# Altium project Flight_controller v1.0.PrjPcb (part 2 of 3)

## Sheet Power_Supply.SchDoc
size A3; Revision: v10; SheetNumber: 3; SheetTotal: 5
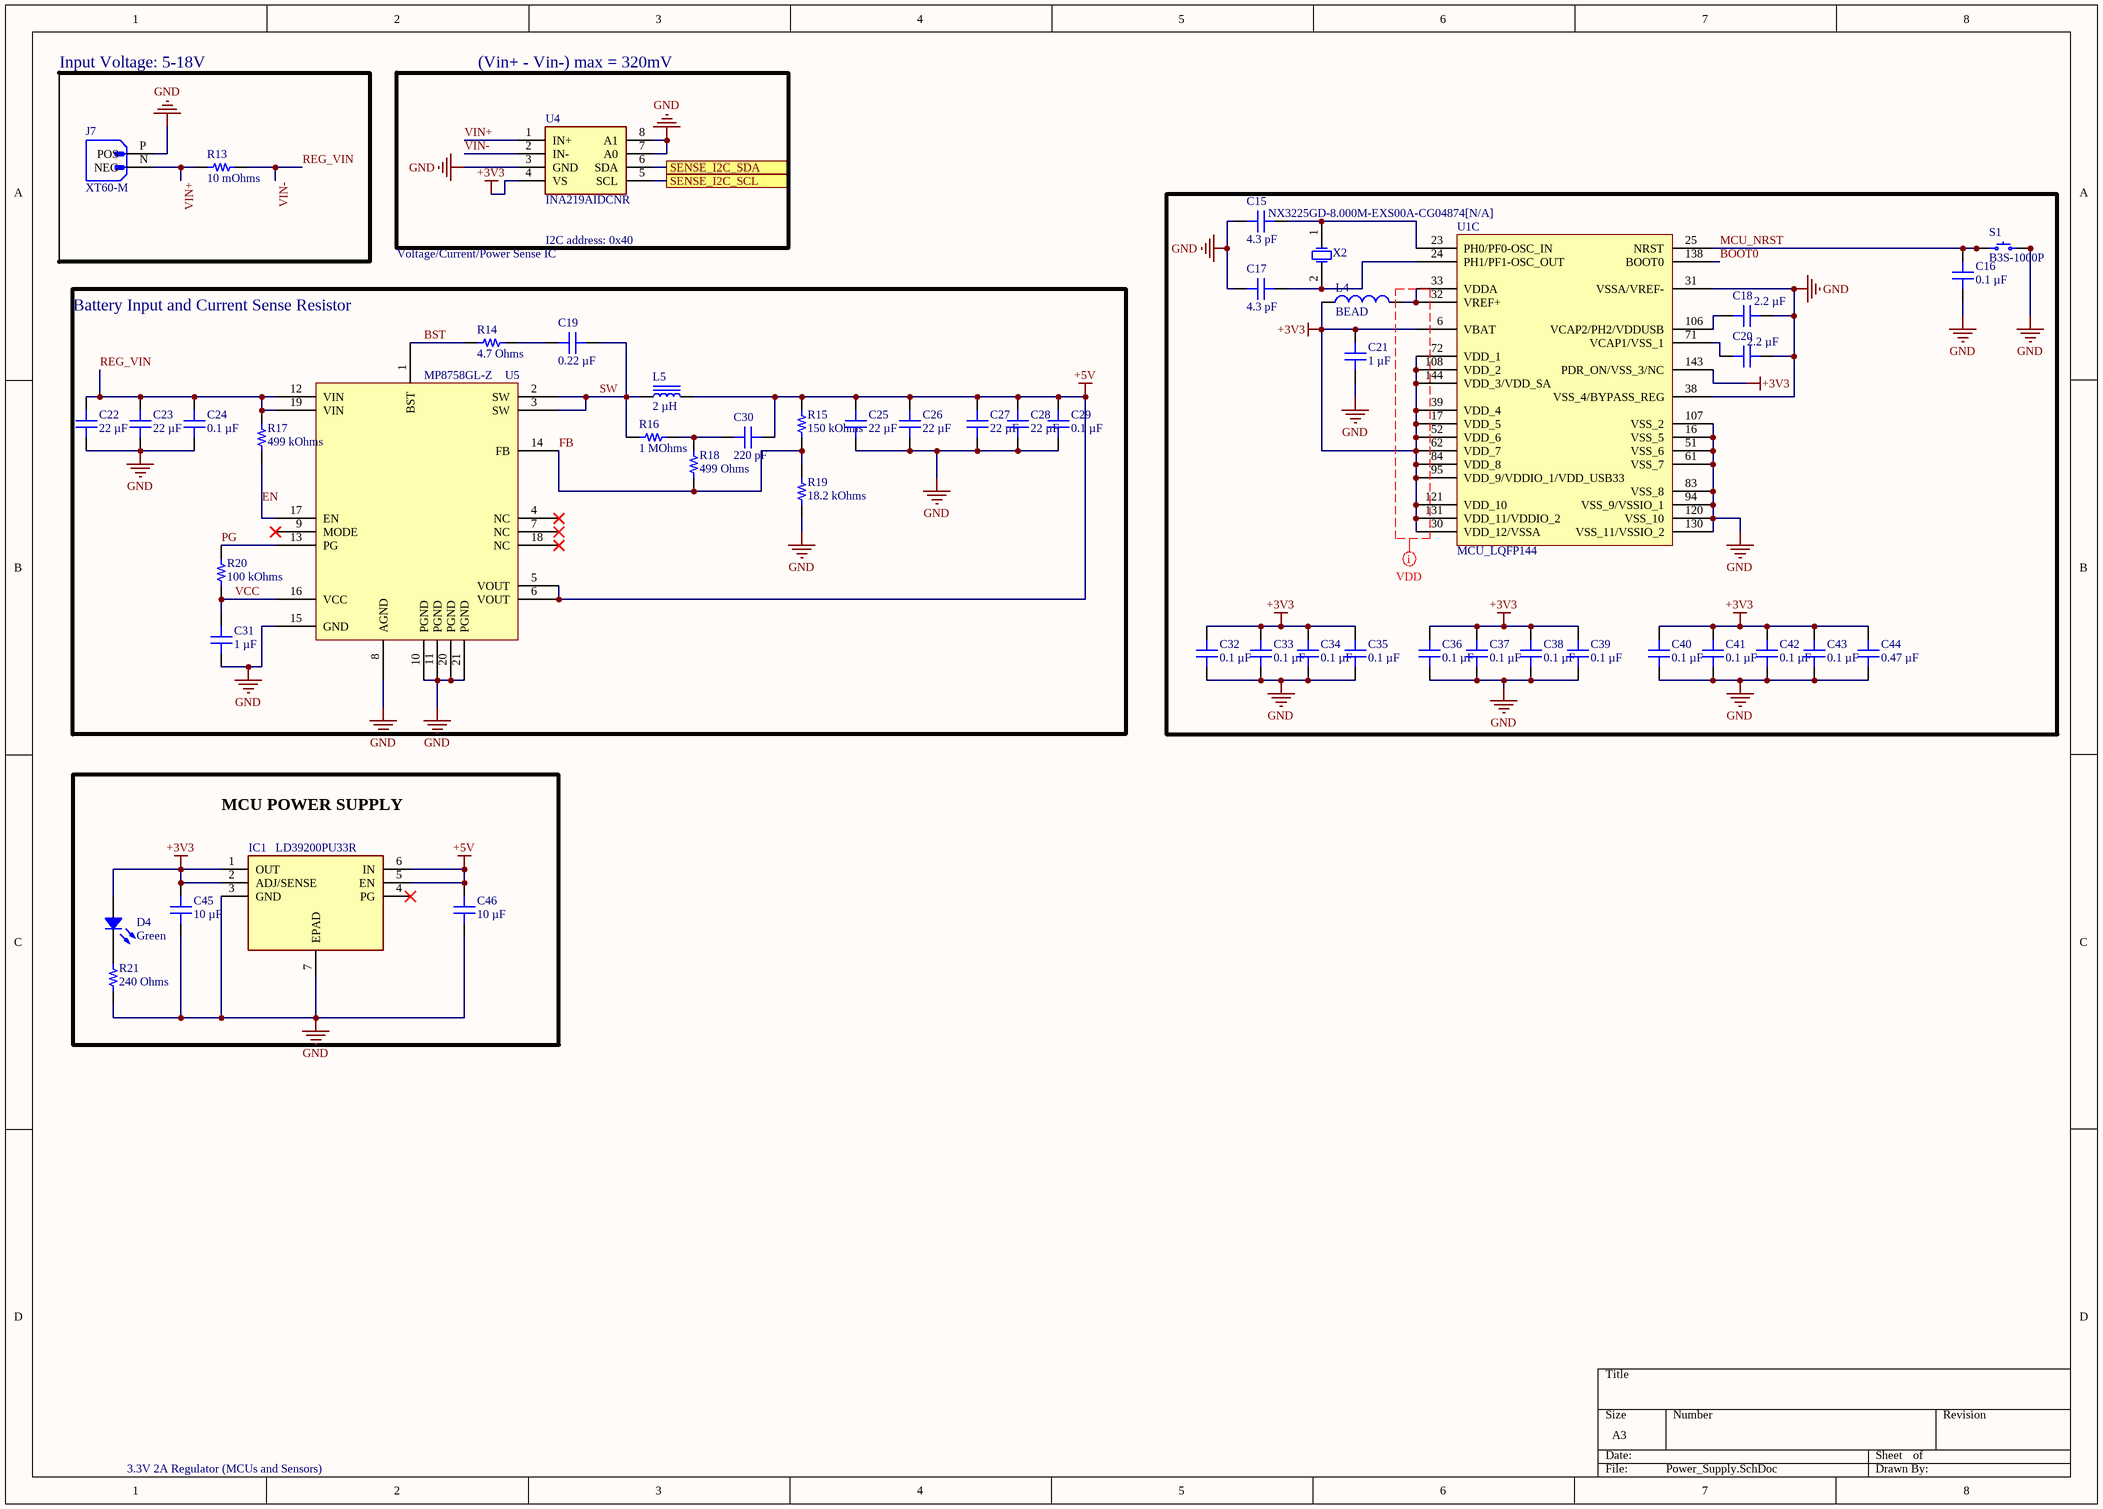
[diagram p2: Power_Supply.SchDoc]

### Parts
C15  4.3 pF  [CAP 0603_1608]
C16  0.1 µF  [CAP 0603_1608]
C17  4.3 pF  [CAP 0603_1608]
C18  2.2 µF  [CAP 1206_3216 - 0.8MM]
C19  0.22 µF  [CAP 0603_1608]
C20  2.2 µF  [CAP 1206_3216 - 0.8MM]
C21  1 µF  [CAP 0603_1608]
C22  22 µF  [CAP 1206_3216 - 0.8MM]
C23  22 µF  [CAP 1206_3216 - 0.8MM]
C24  value 0.1 µF  [CAP 0805_2012]  (hidden comment: 0.1µF)
C25  22 µF  [CAP 1206_3216 - 0.8MM]
C26  22 µF  [CAP 1206_3216 - 0.8MM]
C27  22 µF  [CAP 1206_3216 - 0.8MM]
C28  22 µF  [CAP 1206_3216 - 0.8MM]
C29  value 0.1 µF  [CAP 0603_1608]  (hidden comment: 2.2 µF)
C30  220 pF  [CAP 0603_1608]
C31  1 µF  [CAP 0603_1608]
C32  0.1 µF  [CAP 0603_1608]
C33  0.1 µF  [CAP 0603_1608]
C34  0.1 µF  [CAP 0603_1608]
C35  0.1 µF  [CAP 0603_1608]
C36  0.1 µF  [CAP 0603_1608]
C37  0.1 µF  [CAP 0603_1608]
C38  0.1 µF  [CAP 0603_1608]
C39  0.1 µF  [CAP 0603_1608]
C40  0.1 µF  [CAP 0603_1608]
C41  0.1 µF  [CAP 0603_1608]
C42  0.1 µF  [CAP 0603_1608]
C43  0.1 µF  [CAP 0603_1608]
C44  value 0.47 µF  [CAP 1206_3216 - 1.8MM]  (hidden comment: 22µF)
C45  value 10 µF  [CAP 1206_3216 - 1.8MM]  (hidden comment: 22µF)
C46  value 10 µF  [CAP 0603_1608]  (hidden comment: 0.1 µF)
D4  Green  [LED 0603_1608 GREEN]
IC1  LD39200PU33R  [SON95P300X300X100-7N-D]
J7  XT60-M  [AMASS_XT60-M]
L4  BEAD  [IND_FCM1608_TTC]
L5  2 µH  [WURTH WE-HCI 1365]
R13  10 mOhms  [RES 2512_6432]
R14  4.7 Ohms  [RES 0603_1608]
R15  value 150 kOhms  [RES 0805_2012]  (hidden comment: 6.8 kOhms)
R16  1 MOhms  [RES 0603_1608]
R17  value 499 kOhms  [RES 0805_2012]  (hidden comment: 1.3 kOhms)
R18  499 Ohms  [RES 0603_1608]
R19  value 18.2 kOhms  [RES 0805_2012]  (hidden comment: 10 kOhms)
R20  100 kOhms  [RES 0603_1608]
R21  value 240 Ohms  [RES 0603_1608]  (hidden comment: 160 kOhms)
S1  B3S-1000P  [OMRON B3S-1000P]
U1  MCU_LQFP144  [LQFP144-20x20mm]  (part C of 3)
U4  INA219AIDCNR  [SOP65P280X145-8N]
U5  MP8758GL-Z  [MP8758HGL-Z]
X2  NX3225GD-8.000M-EXS00A-CG04874[N/A]  [XTAL_NX3225GD_NDK]

### Blocks framed on the sheet
Input Voltage: 5-18V: J7 R13
(Vin+ - Vin-) max = 320mV: U4
Battery Input and Current Sense Resistor: C19 C22-C31 L5 R14-R20 U5
MCU POWER SUPPLY: C45 C46 D4 IC1 R21

### Ports
SENSE_I2C_SCL, SENSE_I2C_SDA

### Nets
+3V3: C21.2 C32.2 C33.2 C34.2 C35.2 C36.2 C37.2 C38.2 C39.2 C40.2 C41.2 C42.2 C43.2 C44.2 C45.2 D4.1 IC1.1(OUT) IC1.2(ADJ/SENSE) L4.1 U1.6(VBAT) U1.17(VDD_5) U1.30(VDD_12/VSSA) U1.39(VDD_4) U1.52(VDD_6) U1.62(VDD_7) U1.72(VDD_1) U1.84(VDD_8) U1.95(VDD_9/VDDIO_1/VDD_USB33) U1.108(VDD_2) U1.121(VDD_10) U1.131(VDD_11/VDDIO_2) U1.143(PDR_ON/VSS_3/NC) U1.144(VDD_3/VDD_SA) U4.4(VS)
+5V: C25.2 C26.2 C27.2 C28.2 C29.2 C30.2 C46.2 IC1.5(EN) IC1.6(IN) L5.2 R15.2 U5.5(VOUT) U5.6(VOUT)
GND: C15.1 C16.1 C17.1 C18.2 C20.2 C21.1 C22.1 C23.1 C24.1 C25.1 C26.1 C27.1 C28.1 C29.1 C31.1 C32.1 C33.1 C34.1 C35.1 C36.1 C37.1 C38.1 C39.1 C40.1 C41.1 C42.1 C43.1 C44.1 C45.1 C46.1 IC1.3(GND) IC1.7(EPAD) J7.P(POS) R19.1 R21.1 S1.3 S1.4 U1.16(VSS_5) U1.31(VSSA/VREF-) U1.38(VSS_4/BYPASS_REG) U1.51(VSS_6) U1.61(VSS_7) U1.83(VSS_8) U1.94(VSS_9/VSSIO_1) U1.107(VSS_2) U1.120(VSS_10) U1.130(VSS_11/VSSIO_2) U4.3(GND) U4.7(A0) U4.8(A1) U5.8(AGND) U5.10(PGND) U5.11(PGND) U5.15(GND) U5.20(PGND) U5.21(PGND)
BOOT0: U1.138(BOOT0)
BST: R14.1 U5.1(BST)
EN: R17.1 U5.17(EN)
FB: R15.1 R18.1 R19.2 U5.14(FB)
I2C1_SCA: U4.6(SDA) ; port SENSE_I2C_SDA
I2C1_SCL: U4.5(SCL) ; port SENSE_I2C_SCL
MCU_NRST: C16.2 S1.1 S1.2 U1.25(NRST)
PG: R20.2 U5.13(PG)
REG_VIN: C22.2 C23.2 C24.2 R13.2 R17.2 U4.2(IN-) U5.12(VIN) U5.19(VIN)  [also labelled VIN-]
SW: C19.2 L5.1 R16.2 U5.2(SW) U5.3(SW)
VCC: C31.2 R20.1 U5.16(VCC)
VIN+: J7.N(NEG) R13.1 U4.1(IN+)
NetC15_2: C15.2 U1.23(PH0/PF0-OSC_IN) X2.1(OSC1)
NetC17_2: C17.2 U1.24(PH1/PF1-OSC_OUT) X2.2(OSC2)
NetC18_1: C18.1 U1.106(VCAP2/PH2/VDDUSB)
NetC19_1: C19.1 R14.2
NetC20_1: C20.1 U1.71(VCAP1/VSS_1)
NetC30_1: C30.1 R16.1 R18.2
NetD4_2: D4.2 R21.2
NetL4_2: L4.2 U1.32(VREF+) U1.33(VDDA)

Not connected (* = marked no-connect by the designer): IC1 4(PG)*; U5 4(NC)* 7(NC)* 9(MODE)* 18(NC)*

### Layout directives
net class VDD: (no net found under the mark)

### Notes on the sheet
- I2C address: 0x40
- Voltage/Current/Power Sense IC
- 3.3V 2A Regulator (MCUs and Sensors)

### Library data of the parts
C15 C17 = CC0603CRNPO9BN4R3: CAP CER 4.3PF 50V C0G/NPO 0603; manufacturer: Yageo; Temperature Coefficient: C0G, NP0; Tolerance: ±0.25pF; Part Number: CC0603CRNPO9BN4R3; Value: 4.3 pF; Applications: General Purpose; Capacitance: 4.3 pF; componentlink1description: Datasheet; componentlink1url: https://www.yageo.com/upload/media/product/productsearch/datasheet/mlcc/UPY-GP_NP0_16V-to-50V_17.pdf; componentlink2description: DigiKey Link; componentlink2url: https://www.digikey.com/en/products/detail/yageo/CC0603CRNPO9BN4R3/5883456; Device Package: 0603 (1608 Metric); lastupdated: 3.03.2023 20:08:13; Lifecycle Status: Active; Minimum Order: 1; Mounting Type: Surface Mount, MLCC; Operating Temperature: -55°C ~ 125°C; Package / Case: 0603 (1608 Metric); packaging: TapeAndReel; partid: 15526; Part Status: Active; price: 0.01; series: CC; Size / Dimension: 0.063" L x 0.031" W (1.60mm x 0.80mm); Supplier 1: DigiKey; Supplier Part Number 1: 311-3858-1-ND; Thickness (Max): 0.035" (0.90mm); Voltage - Rated: 50V
C16 C32-C43 = CC0603KRX7R7BB104: CAP CER 0.1UF 16V X7R 0603; manufacturer: Yageo; Tolerance: ±10%; Part Number: CC0603KRX7R7BB104; Value: 0.1 µF; Applications: General Purpose; Capacitance: 0.1 µF; componentlink1description: Datasheet; componentlink1url: https://www.yageo.com/upload/media/product/productsearch/datasheet/mlcc/UPY-GPHC_X7R_6.3V-to-50V_18.pdf; componentlink2description: DigiKey Link; Device Package: 0603 (1608 Metric); Lifecycle Status: Active; Minimum Order: 1; Mounting Type: Surface Mount, MLCC; Operating Temperature: -55°C ~ 125°C; Package / Case: 0603 (1608 Metric); packaging: TapeAndReel; partid: 16746; Part Status: Active; price: 0.01; series: CC; Size / Dimension: 0.063" L x 0.031" W (1.60mm x 0.80mm); Supplier 1: DigiKey; Supplier Part Number 1: 311-1088-1-ND; Temperature Coefficient: X7R; Thickness (Max): 0.035" (0.90mm); Voltage - Rated: 16V
  C16: componentlink2url: https://www.digikey.com/en/products/detail/yageo/CC0603KRX7R7BB104/302822; lastupdated: 8.03.2023 20:08:09
  C32-C43: lastupdated: 20.02.2023 20:07:33
C18 C20 = CC1206KKX7R7BB225: CAP CER 2.2UF 16V X7R 1206; manufacturer: Yageo; Tolerance: ±10%; Part Number: CC1206KKX7R7BB225; Value: 2.2 µF; Applications: General Purpose; Capacitance: 2.2 µF; componentlink1description: Datasheet; componentlink1url: https://www.yageo.com/upload/media/product/productsearch/datasheet/mlcc/UPY-GPHC_X7R_6.3V-to-50V_18.pdf; componentlink2description: DigiKey Link; componentlink2url: https://www.digikey.com/en/products/detail/yageo/CC1206KKX7R7BB225/5195363; Device Package: 1206 (3216 Metric); lastupdated: 20.02.2023 20:13:55; Lifecycle Status: Active; Minimum Order: 1; Mounting Type: Surface Mount, MLCC; Operating Temperature: -55°C ~ 125°C; Package / Case: 1206 (3216 Metric); packaging: TapeAndReel; partid: 21752; Part Status: Active; price: 0.05; series: CC; Size / Dimension: 0.126" L x 0.063" W (3.20mm x 1.60mm); Supplier 1: DigiKey; Supplier Part Number 1: 311-1957-1-ND; Temperature Coefficient: X7R; Thickness (Max): 0.049" (1.25mm); Voltage - Rated: 16V
C19 = CL10B224KA8NNNC: CAP CER 0.22UF 25V X7R 0603; manufacturer: Samsung Electro-Mechanics; Tolerance: ±10%; Part Number: CL10B224KA8NNNC; Value: 0.22 µF; Applications: General Purpose; Capacitance: 0.22 µF; componentlink1description: Datasheet; componentlink1url: http://www.samsungsem.com/kr/support/product-search/mlcc/CL10B224KA8NNNC.jsp; componentlink2description: DigiKey Link; componentlink2url: https://www.digikey.com/en/products/detail/samsung-electro-mechanics/CL10B224KA8NNNC/3886769; Device Package: 0603 (1608 Metric); lastupdated: 3.03.2023 20:08:19; Lifecycle Status: Active; Minimum Order: 1; Mounting Type: Surface Mount, MLCC; Operating Temperature: -55°C ~ 125°C; Package / Case: 0603 (1608 Metric); packaging: TapeAndReel; partid: 14278; Part Status: Active; price: 0.01; series: CL; Size / Dimension: 0.063" L x 0.031" W (1.60mm x 0.80mm); Supplier 1: DigiKey; Supplier Part Number 1: 1276-1111-1-ND; Temperature Coefficient: X7R; Thickness (Max): 0.035" (0.90mm); Voltage - Rated: 25V
C21 = CL10A105KO8NNNC: CAP CER 1UF 16V X5R 0603; manufacturer: Samsung Electro-Mechanics; Tolerance: ±10%; Part Number: CL10A105KO8NNNC; Value: 1 µF; Applications: General Purpose; Capacitance: 1 µF; componentlink1description: Datasheet; componentlink1url: http://www.samsungsem.com/kr/support/product-search/mlcc/CL10A105KO8NNNC.jsp; componentlink2description: DigiKey Link; componentlink2url: https://www.digikey.com/en/products/detail/samsung-electro-mechanics/CL10A105KO8NNNC/3886692; Device Package: 0603 (1608 Metric); lastupdated: 28.02.2023 20:08:28; Lifecycle Status: Active; Minimum Order: 1; Mounting Type: Surface Mount, MLCC; Operating Temperature: -55°C ~ 85°C; Package / Case: 0603 (1608 Metric); packaging: TapeAndReel; partid: 5514; Part Status: Active; price: 0.01; series: CL; Size / Dimension: 0.063" L x 0.031" W (1.60mm x 0.80mm); Supplier 1: DigiKey; Supplier Part Number 1: 1276-1034-1-ND; Temperature Coefficient: X5R; Thickness (Max): 0.035" (0.90mm); Voltage - Rated: 16V
C22 C23 = CL31A226KAHNNNE: CAP CER 22UF 25V X5R 1206; manufacturer: Samsung Electro-Mechanics; Tolerance: ±10%; Part Number: CL31A226KAHNNNE; Value: 22 µF; Applications: General Purpose; Capacitance: 22 µF; componentlink1description: Datasheet; componentlink1url: http://www.samsungsem.com/kr/support/product-search/mlcc/CL31A226KAHNNNE.jsp; componentlink2description: DigiKey Link; componentlink2url: https://www.digikey.com/en/products/detail/samsung-electro-mechanics/CL31A226KAHNNNE/3888705; Device Package: 1206 (3216 Metric); lastupdated: 3.03.2023 20:14:18; Lifecycle Status: Active; Minimum Order: 1; Mounting Type: Surface Mount, MLCC; Operating Temperature: -55°C ~ 85°C; Package / Case: 1206 (3216 Metric); packaging: TapeAndReel; partid: 22185; Part Status: Active; price: 0.07; series: CL; Size / Dimension: 0.126" L x 0.063" W (3.20mm x 1.60mm); Supplier 1: DigiKey; Supplier Part Number 1: 1276-3047-1-ND; Temperature Coefficient: X5R; Thickness (Max): 0.071" (1.80mm); Voltage - Rated: 25V
C24 C29 = CL10B104KA8NNNC: CAP CER 0.1UF 25V X7R 0603; manufacturer: Samsung Electro-Mechanics; Tolerance: ±10%; Part Number: CL10B104KA8NNNC; Applications: General Purpose; Capacitance: 0.1 µF; componentlink1description: Datasheet; componentlink1url: http://www.samsungsem.com/kr/support/product-search/mlcc/CL10B104KA8NNNC.jsp; componentlink2description: DigiKey Link; componentlink2url: https://www.digikey.com/en/products/detail/samsung-electro-mechanics/CL10B104KA8NNNC/3886664; Device Package: 0603 (1608 Metric); lastupdated: 1.03.2023 20:07:31; Lifecycle Status: Active; Minimum Order: 1; Mounting Type: Surface Mount, MLCC; Operating Temperature: -55°C ~ 125°C; Package / Case: 0603 (1608 Metric); packaging: TapeAndReel; partid: 9793; Part Status: Active; price: 0.01; series: CL; Size / Dimension: 0.063" L x 0.031" W (1.60mm x 0.80mm); Supplier 1: DigiKey; Supplier Part Number 1: 1276-1006-1-ND; Temperature Coefficient: X7R; Thickness (Max): 0.035" (0.90mm); Voltage - Rated: 25V
C25-C28 = EMK316BJ226ML-T: CAP CER 22UF 16V X5R 1206; manufacturer: Taiyo Yuden; Tolerance: ±20%; Part Number: EMK316BJ226ML-T; Value: 22 µF; Applications: SMPS Filtering; Capacitance: 22 µF; componentlink1description: Datasheet; componentlink1url: https://www.yuden.co.jp/productdata/catalog/mlcc01_e.pdf; componentlink2description: DigiKey Link; componentlink2url: https://www.digikey.com/en/products/detail/taiyo-yuden/EMK316BJ226ML-T/1004021; Device Package: 1206 (3216 Metric); lastupdated: 3.03.2023 20:14:18; Lifecycle Status: Active; Minimum Order: 1; Mounting Type: Surface Mount, MLCC; Operating Temperature: -55°C ~ 85°C; Package / Case: 1206 (3216 Metric); packaging: TapeAndReel; partid: 39350; Part Status: Active; price: 0.11; series: M; Size / Dimension: 0.126" L x 0.063" W (3.20mm x 1.60mm); Supplier 1: DigiKey; Supplier Part Number 1: 587-1433-1-ND; Temperature Coefficient: X5R; Thickness (Max): 0.071" (1.80mm); Voltage - Rated: 16V
C30 = CL10B221KB8NNNC: CAP CER 220PF 50V X7R 0603; manufacturer: Samsung Electro-Mechanics; Tolerance: ±10%; Part Number: CL10B221KB8NNNC; Value: 220 pF; Applications: General Purpose; Capacitance: 220 pF; componentlink1description: Datasheet; componentlink1url: http://www.samsungsem.com/kr/support/product-search/mlcc/CL10B221KB8NNNC.jsp; componentlink2description: DigiKey Link; componentlink2url: https://www.digikey.com/en/products/detail/samsung-electro-mechanics/CL10B221KB8NNNC/3886803; Device Package: 0603 (1608 Metric); lastupdated: 1.03.2023 20:07:31; Lifecycle Status: Active; Minimum Order: 1; Mounting Type: Surface Mount, MLCC; Operating Temperature: -55°C ~ 125°C; Package / Case: 0603 (1608 Metric); packaging: TapeAndReel; partid: 9841; Part Status: Active; price: 0.01; series: CL; Size / Dimension: 0.063" L x 0.031" W (1.60mm x 0.80mm); Supplier 1: DigiKey; Supplier Part Number 1: 1276-1145-1-ND; Temperature Coefficient: X7R; Thickness (Max): 0.035" (0.90mm); Voltage - Rated: 50V
C31 = CL10B105KA8NNNC: CAP CER 1UF 25V X7R 0603; manufacturer: Samsung Electro-Mechanics; Tolerance: ±10%; Part Number: CL10B105KA8NNNC; Value: 1 µF; Applications: General Purpose; Capacitance: 1 µF; componentlink1description: Datasheet; componentlink1url: http://www.samsungsem.com/kr/support/product-search/mlcc/CL10B105KA8NNNC.jsp; componentlink2description: DigiKey Link; componentlink2url: https://www.digikey.com/en/products/detail/samsung-electro-mechanics/CL10B105KA8NNNC/3886842; Device Package: 0603 (1608 Metric); lastupdated: 1.03.2023 20:07:43; Lifecycle Status: Active; Minimum Order: 1; Mounting Type: Surface Mount, MLCC; Operating Temperature: -55°C ~ 125°C; Package / Case: 0603 (1608 Metric); packaging: TapeAndReel; partid: 5552; Part Status: Active; price: 0.01; series: CL; Size / Dimension: 0.063" L x 0.031" W (1.60mm x 0.80mm); Supplier 1: DigiKey; Supplier Part Number 1: 1276-1184-1-ND; Temperature Coefficient: X7R; Thickness (Max): 0.035" (0.90mm); Voltage - Rated: 25V
C44 = CC0603KRX7R7BB474: CAP CER 0.47UF 16V X7R 0603; manufacturer: Yageo; Tolerance: ±10%; Part Number: CC0603KRX7R7BB474; Applications: General Purpose; Capacitance: 0.47 µF; componentlink1description: Datasheet; componentlink1url: https://www.yageo.com/upload/media/product/productsearch/datasheet/mlcc/UPY-GPHC_X7R_6.3V-to-50V_18.pdf; componentlink2description: DigiKey Link; componentlink2url: https://www.digikey.com/en/products/detail/yageo/CC0603KRX7R7BB474/2833593; Device Package: 0603 (1608 Metric); lastupdated: 28.02.2023 20:07:55; Lifecycle Status: Active; Minimum Order: 1; Mounting Type: Surface Mount, MLCC; Operating Temperature: -55°C ~ 125°C; Package / Case: 0603 (1608 Metric); packaging: TapeAndReel; partid: 15872; Part Status: Active; price: 0.02; series: CC; Size / Dimension: 0.063" L x 0.031" W (1.60mm x 0.80mm); Supplier 1: DigiKey; Supplier Part Number 1: 311-1428-1-ND; Temperature Coefficient: X7R; Thickness (Max): 0.035" (0.90mm); Voltage - Rated: 16V
C45 C46 = GRM188R61C106MA73D: CAP CER 10UF 16V X5R 0603; manufacturer: Murata Electronics; Tolerance: ±20%; Part Number: GRM188R61C106MA73D; Applications: General Purpose; Capacitance: 10 µF; componentlink1description: Datasheet; componentlink1url: https://www.murata.com/~/media/webrenewal/support/library/catalog/products/capacitor/mlcc/c02e.ashx?la=en-us; componentlink2description: DigiKey Link; componentlink2url: https://www.digikey.com/en/products/detail/murata-electronics/GRM188R61C106MA73D/3900480; Device Package: 0603 (1608 Metric); lastupdated: 3.03.2023 20:08:15; Lifecycle Status: Active; Minimum Order: 1; Mounting Type: Surface Mount, MLCC; Operating Temperature: -55°C ~ 85°C; Package / Case: 0603 (1608 Metric); packaging: TapeAndReel; partid: 15141; Part Status: Active; price: 0.04; series: GRM; Size / Dimension: 0.063" L x 0.031" W (1.60mm x 0.80mm); Supplier 1: DigiKey; Supplier Part Number 1: 490-7201-1-ND; Temperature Coefficient: X5R; Thickness (Max): 0.039" (1.00mm); Voltage - Rated: 16V
D4 = LTST-C190KGKT: LED GREEN CLEAR CHIP SMD; Manufacturer: Lite-On Inc.; Configuration: Standard; Current - Test: 20mA; Lens Color: Colorless; Lens Size: 1.10mm x 0.80mm; Lens Style: Rectangle with Flat Top; Millicandela Rating: 35mcd; Viewing Angle: 130°; Voltage - Forward (Vf) (Typ): 2V; Wavelength - Dominant: 571nm; Wavelength - Peak: 574nm; Part Number: LTST-C190KGKT; Color: Green; ComponentLink1Description: Datasheet; ComponentLink1URL: http://optoelectronics.liteon.com/upload/download/DS22-2000-074/LTST-C190KGKT.PDF; ComponentLink2Description: DigiKey Link; ComponentLink2URL: http://digikey.com/product-detail/en/lite-on-inc/LTST-C190KGKT/160-1435-1-ND/386814; Device Package: 0603 (1608 Metric); Height (Max): 0.90mm; LastUpdated: 3.03.2023 20:56:01; Lens Transparency: Clear; Lifecycle Status: Active; Minimum Order: 1; Mounting Type: Surface Mount; Package / Case: 0603 (1608 Metric); Packaging: TapeAndReel; PartId: 657; Part Status: Active; Price: 0.04; Series: -; Size / Dimension: 1.60mm L x 0.80mm W; Supplier 1: DigiKey; Supplier Part Number 1: 160-1435-1-ND; Supplier Device Package: Chip LED; Value: Green
IC1 = LD39200PU33R: Integrated Circuit; Manufacturer_Name: STMicroelectronics; Datasheet Link: https://www.st.com/resource/en/datasheet/ld39200.pdf; Height: 1mm; Manufacturer_Part_Number: LD39200PU33R; Mouser Part Number: 511-LD39200PU33R; Mouser Price/Stock: https://www.mouser.co.uk/ProductDetail/STMicroelectronics/LD39200PU33R?qs=WHlX%252B%252B9%2FRwAl6%2FJDqRS1uw%3D%3D; Arrow Part Number: LD39200PU33R; Arrow Price/Stock: https://www.arrow.com/en/products/ld39200pu33r/stmicroelectronics?region=nac
J7 = XT60-M: Plug; DC supply; XT60; male; PIN: 2; for cable; soldered; 30A; 500V; MF: AMASS; Price: None; Availability: Not in stock; Package: Package; MP: XT60-M; Value: *; SnapEDA_Link: https://www.snapeda.com/parts/XT60-M/AMASS/view-part/?ref=snap; Check_prices: https://www.snapeda.com/parts/XT60-M/AMASS/view-part/?ref=eda
L4 = Inductor_1: Inductor; Value: 100uH; Published: 8-Jun-2000; Revision: July-2002: Re-released for DXP Platform.; Publisher: Altium Limited
L5 = 7443551200: FIXED IND 2UH 23A 2.6 MOHM SMD; Manufacturer: Würth Elektronik; Current - Saturation: 22A; Frequency - Self Resonant: 45MHz; Inductance Frequency - Test: 100 kHz; Material - Core: Nonstandard; Shielding: Shielded; Tolerance: ±20%; Type: Wirewound; Part Number: 7443551200; ComponentLink1Description: Datasheet; ComponentLink1URL: https://katalog.we-online.de/pbs/datasheet/7443551200.pdf; ComponentLink2Description: DigiKey Link; ComponentLink2URL: https://www.digikey.com/en/products/detail/würth-elektronik/7443551200/1638530; Current Rating (Amps): 23 A; DC Resistance (DCR): 2.6mOhm; Device Package: Nonstandard; Height - Seated (Max): 0.256" (6.50mm); Inductance: 2 µH; LastUpdated: 26.02.2023 21:15:50; Lifecycle Status: Active; Minimum Order: 1; Mounting Type: Surface Mount; Operating Temperature: -40°C ~ 155°C; Package / Case: Nonstandard; Packaging: TapeAndReel; PartId: 5626; Part Status: Active; Price: 2.50; Ratings: AEC-Q200; Series: WE-HCI; Size / Dimension: 0.512" L x 0.504" W (13.00mm x 12.80mm); Supplier 1: DigiKey; Supplier Part Number 1: 732-1125-1-ND; Supplier Device Package: 1365; Value: 2 µH
R13 = Y14870R01000D5W: RES 0.01 OHM 0.5% 1W 2512; Manufacturer: Vishay Foil Resistors (Division of Vishay Precision Group); Temperature Coefficient: ±15ppm/°C; Part Number: Y14870R01000D5W; ComponentLink1Description: Datasheet; ComponentLink1URL: http://www.vishaypg.com/docs/63089/csm.pdf; ComponentLink2Description: DigiKey Link; ComponentLink2URL: http://digikey.com/product-detail/en/vishay-foil-resistors-division-of-vishay-precision-group/Y14870R01000D5W/804-1135-ND/6028839; Composition: Metal Foil; Device Package: 2512 (6432 Metric); Features: Current Sense, Moisture Resistant; Height - Seated (Max): 0.035" (0.89mm); LastUpdated: 2.09.2020 01:26:50; Lifecycle Status: Active; Minimum Order: 1; Number of Terminations: 4; Operating Temperature: -65°C ~ 170°C; Package / Case: 2512 (6432 Metric); Packaging: Tray; Part Status: Active; Power (Watts): 1W; Price: 29.11; Resistance: 10 mOhms; Series: CSM; Size / Dimension: 0.250" L x 0.125" W (6.35mm x 3.18mm); Supplier 1: DigiKey; Supplier Part Number 1: 804-1135-ND; Supplier Device Package: 2512; Tolerance: ±0.5%; Value: 10 mOhms
R14 = ERJ-3GEYJ4R7V: RES SMD 4.7 OHM 5% 1/10W 0603; Manufacturer: Panasonic Electronic Components; Power (Watts): 0.1W, 1/10W; Temperature Coefficient: -100/ +600ppm/°C; Part Number: ERJ-3GEYJ4R7V; Value: 4.7 Ohms; ComponentLink1Description: Datasheet; ComponentLink1URL: http://industrial.panasonic.com/www-cgi/jvcr13pz.cgi?E+PZ+3+AOA0001+ERJ3GEYJ4R7V+7+WW; ComponentLink2Description: DigiKey Link; ComponentLink2URL: https://www.digikey.com/en/products/detail/panasonic-electronic-components/ERJ-3GEYJ4R7V/282127; Composition: Thick Film; Device Package: 0603 (1608 Metric); Features: Automotive AEC-Q200; Height - Seated (Max): 0.022" (0.55mm); LastUpdated: 1.03.2023 20:28:11; Lifecycle Status: Active; Minimum Order: 1; Number of Terminations: 2; Operating Temperature: -55°C ~ 155°C; Package / Case: 0603 (1608 Metric); Packaging: TapeAndReel; PartId: 12953; Part Status: Active; Price: 0.01; Ratings: AEC-Q200; Resistance: 4.7 Ohms; Series: ERJ-3G; Size / Dimension: 0.063" L x 0.031" W (1.60mm x 0.80mm); Supplier 1: DigiKey; Supplier Part Number 1: P4.7GCT-ND; Supplier Device Package: 0603; Tolerance: ±5%
R15 = RC0603FR-07150KL: RES 150K OHM 1% 1/10W 0603; Manufacturer: Yageo; Power (Watts): 0.1W, 1/10W; Temperature Coefficient: ±100ppm/°C; Part Number: RC0603FR-07150KL; ComponentLink1Description: Datasheet; ComponentLink1URL: https://www.yageo.com/upload/media/product/productsearch/datasheet/rchip/PYu-RC_Group_51_RoHS_L_10.pdf; ComponentLink2Description: DigiKey Link; ComponentLink2URL: https://www.digikey.com/en/products/detail/yageo/RC0603FR-07150KL/726959; Composition: Thick Film; Device Package: 0603 (1608 Metric); Features: Moisture Resistant; Height - Seated (Max): 0.022" (0.55mm); LastUpdated: 1.03.2023 20:27:44; Lifecycle Status: Active; Minimum Order: 1; Number of Terminations: 2; Operating Temperature: -55°C ~ 155°C; Package / Case: 0603 (1608 Metric); Packaging: CutTape; PartId: 18953; Part Status: Active; Price: 0.01; Resistance: 150 kOhms; Series: RC_L; Size / Dimension: 0.063" L x 0.031" W (1.60mm x 0.80mm); Supplier 1: DigiKey; Supplier Part Number 1: 311-150KHRCT-ND; Supplier Device Package: 0603; Tolerance: ±1%
R16 = RT0603BRD071ML: RES SMD 1M OHM 0.1% 1/10W 0603; Manufacturer: Yageo; Power (Watts): 0.1W, 1/10W; Temperature Coefficient: ±25ppm/°C; Part Number: RT0603BRD071ML; Value: 1 MOhms; ComponentLink1Description: Datasheet; ComponentLink1URL: https://www.yageo.com/upload/media/product/productsearch/datasheet/rchip/PYu-RT_1-to-0.01_RoHS_L_11.pdf; ComponentLink2Description: DigiKey Link; ComponentLink2URL: https://www.digikey.com/en/products/detail/yageo/RT0603BRD071ML/5927906; Composition: Thin Film; Device Package: 0603 (1608 Metric); Height - Seated (Max): 0.022" (0.55mm); LastUpdated: 26.02.2023 20:29:08; Lifecycle Status: Active; Minimum Order: 1; Number of Terminations: 2; Operating Temperature: -55°C ~ 155°C; Package / Case: 0603 (1608 Metric); Packaging: TapeAndReel; PartId: 5503; Part Status: Active; Price: 0.03; Resistance: 1 MOhms; Series: RT; Size / Dimension: 0.063" L x 0.031" W (1.60mm x 0.80mm); Supplier 1: DigiKey; Supplier Part Number 1: YAG4498CT-ND; Supplier Device Package: 0603; Tolerance: ±0.1%
R17 = RC0603FR-07499KL: RES 499K OHM 1% 1/10W 0603; Manufacturer: Yageo; Power (Watts): 0.1W, 1/10W; Temperature Coefficient: ±100ppm/°C; Part Number: RC0603FR-07499KL; ComponentLink1Description: Datasheet; ComponentLink1URL: https://www.yageo.com/upload/media/product/productsearch/datasheet/rchip/PYu-RC_Group_51_RoHS_L_10.pdf; ComponentLink2Description: DigiKey Link; ComponentLink2URL: https://www.digikey.com/en/products/detail/yageo/RC0603FR-07499KL/727267; Composition: Thick Film; Device Package: 0603 (1608 Metric); Features: Moisture Resistant; Height - Seated (Max): 0.022" (0.55mm); LastUpdated: 1.03.2023 20:27:44; Lifecycle Status: Active; Minimum Order: 1; Number of Terminations: 2; Operating Temperature: -55°C ~ 155°C; Package / Case: 0603 (1608 Metric); Packaging: CutTape; PartId: 19063; Part Status: Active; Price: 0.01; Resistance: 499 kOhms; Series: RC_L; Size / Dimension: 0.063" L x 0.031" W (1.60mm x 0.80mm); Supplier 1: DigiKey; Supplier Part Number 1: 311-499KHRCT-ND; Supplier Device Package: 0603; Tolerance: ±1%
R18 = RC0603FR-07499RL: RES 499 OHM 1% 1/10W 0603; Manufacturer: Yageo; Power (Watts): 0.1W, 1/10W; Temperature Coefficient: ±100ppm/°C; Part Number: RC0603FR-07499RL; Value: 499 Ohms; ComponentLink1Description: Datasheet; ComponentLink1URL: https://www.yageo.com/upload/media/product/productsearch/datasheet/rchip/PYu-RC_Group_51_RoHS_L_10.pdf; ComponentLink2Description: DigiKey Link; ComponentLink2URL: https://www.digikey.com/en/products/detail/yageo/RC0603FR-07499RL/727266; Composition: Thick Film; Device Package: 0603 (1608 Metric); Features: Moisture Resistant; Height - Seated (Max): 0.022" (0.55mm); LastUpdated: 3.03.2023 20:28:56; Lifecycle Status: Active; Minimum Order: 1; Number of Terminations: 2; Operating Temperature: -55°C ~ 155°C; Package / Case: 0603 (1608 Metric); Packaging: CutTape; PartId: 18973; Part Status: Active; Price: 0.01; Resistance: 499 Ohms; Series: RC_L; Size / Dimension: 0.063" L x 0.031" W (1.60mm x 0.80mm); Supplier 1: DigiKey; Supplier Part Number 1: 311-499HRCT-ND; Supplier Device Package: 0603; Tolerance: ±1%
R19 = RC0603FR-0718K2L: RES 18.2K OHM 1% 1/10W 0603; Manufacturer: Yageo; Power (Watts): 0.1W, 1/10W; Temperature Coefficient: ±100ppm/°C; Part Number: RC0603FR-0718K2L; ComponentLink1Description: Datasheet; ComponentLink1URL: https://www.yageo.com/upload/media/product/productsearch/datasheet/rchip/PYu-RC_Group_51_RoHS_L_10.pdf; ComponentLink2Description: DigiKey Link; ComponentLink2URL: https://www.digikey.com/en/products/detail/yageo/RC0603FR-0718K2L/726991; Composition: Thick Film; Device Package: 0603 (1608 Metric); Features: Moisture Resistant; Height - Seated (Max): 0.022" (0.55mm); LastUpdated: 1.03.2023 20:28:12; Lifecycle Status: Active; Minimum Order: 1; Number of Terminations: 2; Operating Temperature: -55°C ~ 155°C; Package / Case: 0603 (1608 Metric); Packaging: CutTape; PartId: 12504; Part Status: Active; Price: 0.01; Resistance: 18.2 kOhms; Series: RC_L; Size / Dimension: 0.063" L x 0.031" W (1.60mm x 0.80mm); Supplier 1: DigiKey; Supplier Part Number 1: 311-18.2KHRCT-ND; Supplier Device Package: 0603; Tolerance: ±1%
R20 = RC0603FR-07100KL: RES 100K OHM 1% 1/10W 0603; Manufacturer: Yageo; Power (Watts): 0.1W, 1/10W; Temperature Coefficient: ±100ppm/°C; Part Number: RC0603FR-07100KL; Value: 100 kOhms; ComponentLink1Description: Datasheet; ComponentLink1URL: https://www.yageo.com/upload/media/product/productsearch/datasheet/rchip/PYu-RC_Group_51_RoHS_L_10.pdf; ComponentLink2Description: DigiKey Link; ComponentLink2URL: https://www.digikey.com/en/products/detail/yageo/RC0603FR-07100KL/726889; Composition: Thick Film; Device Package: 0603 (1608 Metric); Features: Moisture Resistant; Height - Seated (Max): 0.022" (0.55mm); LastUpdated: 3.03.2023 20:28:31; Lifecycle Status: Active; Minimum Order: 1; Number of Terminations: 2; Operating Temperature: -55°C ~ 155°C; Package / Case: 0603 (1608 Metric); Packaging: CutTape; PartId: 23948; Part Status: Active; Price: 0.01; Resistance: 100 kOhms; Series: RC_L; Size / Dimension: 0.063" L x 0.031" W (1.60mm x 0.80mm); Supplier 1: DigiKey; Supplier Part Number 1: 311-100KHRCT-ND; Supplier Device Package: 0603; Tolerance: ±1%
R21 = RC0603FR-07240RL: RES 240 OHM 1% 1/10W 0603; Manufacturer: Yageo; Power (Watts): 0.1W, 1/10W; Temperature Coefficient: ±100ppm/°C; Part Number: RC0603FR-07240RL; ComponentLink1Description: Datasheet; ComponentLink1URL: https://www.yageo.com/upload/media/product/productsearch/datasheet/rchip/PYu-RC_Group_51_RoHS_L_10.pdf; ComponentLink2Description: DigiKey Link; ComponentLink2URL: https://www.digikey.com/en/products/detail/yageo/RC0603FR-07240RL/727081; Composition: Thick Film; Device Package: 0603 (1608 Metric); Features: Moisture Resistant; Height - Seated (Max): 0.022" (0.55mm); LastUpdated: 3.03.2023 20:28:56; Lifecycle Status: Active; Minimum Order: 1; Number of Terminations: 2; Operating Temperature: -55°C ~ 155°C; Package / Case: 0603 (1608 Metric); Packaging: CutTape; PartId: 19025; Part Status: Active; Price: 0.01; Resistance: 240 Ohms; Series: RC_L; Size / Dimension: 0.063" L x 0.031" W (1.60mm x 0.80mm); Supplier 1: DigiKey; Supplier Part Number 1: 311-240HRCT-ND; Supplier Device Package: 0603; Tolerance: ±1%
S1 = B3S-1000P: SWITCH TACTILE SPST-NO 0.05A 24V; Manufacturer: Omron Electronics Inc-EMC Div; Actuator Height off PCB, Vertical: 4.30mm; Actuator Orientation: Top Actuated; Actuator Type: Standard; Contact Rating @ Voltage: 0.05A @ 24VDC; Illumination: Non-Illuminated; Ingress Protection: IP67 - Dust Tight, Waterproof; Operating Force: 160gf; Outline: 6.60mm x 6.00mm; Switch Function: Off-Mom; Part Number: B3S-1000P; Circuit: SPST-NO; ComponentLink1Description: Datasheet; ComponentLink1URL: https://omronfs.omron.com/en_US/ecb/products/pdf/en-b3s.pdf; ComponentLink2Description: DigiKey Link; ComponentLink2URL: http://digikey.com/product-detail/en/omron-electronics-inc-emc-div/B3S-1000P/SW836CT-ND/700012; Features: Sealed - Fully; LastUpdated: 9.04.2020 09:57:13; Lifecycle Status: Active; Minimum Order: 1; Mounting Type: Surface Mount; Operating Temperature: -25°C ~ 70°C; Packaging: TapeAndReel; Part Status: Active; Price: 0.39; Series: B3S; Supplier 1: DigiKey; Supplier Part Number 1: SW836CT-ND; Termination Style: Gull Wing
U4 = INA219AIDCNR: Integrated Circuit; Manufacturer_Name: Texas Instruments; Datasheet Link: https://componentsearchengine.com/Datasheets/2/INA219AIDCNR.pdf; Height: 1.45mm; Manufacturer_Part_Number: INA219AIDCNR; Mouser Part Number: 595-INA219AIDCNR; Mouser Price/Stock: https://www.mouser.co.uk/ProductDetail/Texas-Instruments/INA219AIDCNR?qs=NNt36bEIu0tiHc879dL2eg%3D%3D; Arrow Part Number: INA219AIDCNR; Arrow Price/Stock: https://www.arrow.com/en/products/ina219aidcnr/texas-instruments
U5 = MP8758GL-Z: No Description Available; Mfr_Name: Monolithic Power Systems; Copyright: Copyright (C) 2023 Ultra Librarian. All rights reserved.; Manufacturer_Part_Number: MP8758GL-Z; RefDes: RefDes; Type: DEV
X2 = XTAL: Crystal Oscillator; Published: 8-Jun-2000; LatestRevisionDate: 17-Jul-2002; LatestRevisionNote: Re-released for DXP Platform.; PackageReference: R38; Publisher: Altium Limited